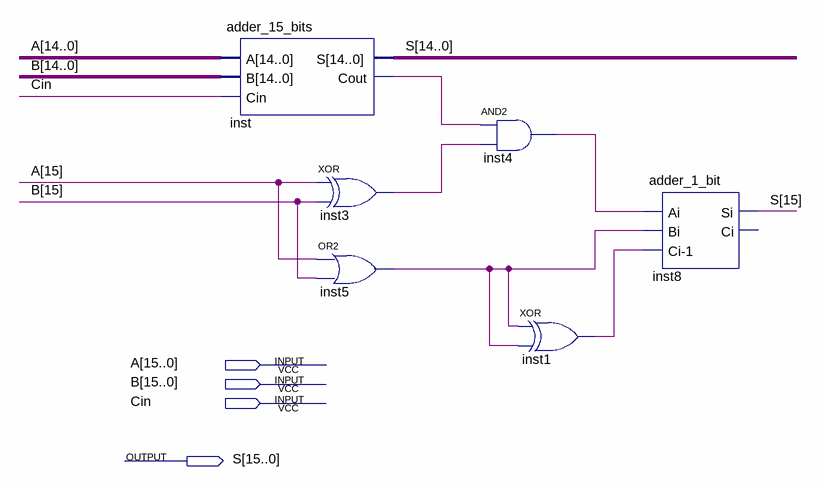
[diagram p0: schematic sheet]
// Quartus schematic signed_adder_16_bits.bdf as structural Verilog: 6 symbols, 4 pins
module signed_adder_16_bits (
  input  [15:0] A,
  input  [15:0] B,
  input  Cin,
  output [15:0] S
);

  wire inst1_out, inst3_out, inst4_out, inst5_out, inst_cout;

  adder_15_bits inst (.A(A[14:0]), .B(B[14:0]), .Cin(Cin), .S(S[14:0]), .Cout(inst_cout));
  xor inst3 (inst3_out, A[15], B[15]);
  or inst5 (inst5_out, A[15], B[15]);
  and inst4 (inst4_out, inst_cout, inst3_out);
  xor inst1 (inst1_out, inst5_out, inst5_out);
  adder_1_bit inst8 (.Ai(inst4_out), .Bi(inst5_out), .\Ci-1 (inst1_out), .Si(S[15]));  // open: Ci
endmodule
